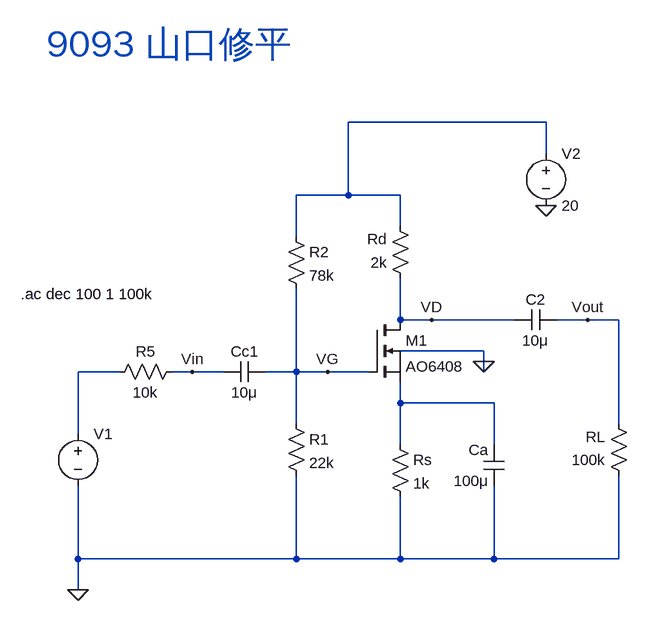
[diagram p0: schematic Draft6.asc]
Draft6.asc, the LTspice schematic file:
Version 4
SHEET 1 948 680
WIRE 816 -144 512 -144
WIRE 816 -96 816 -144
WIRE 512 -32 512 -144
WIRE 512 -32 432 -32
WIRE 592 -32 512 -32
WIRE 592 16 592 -32
WIRE 432 32 432 -32
WIRE 592 160 592 96
WIRE 640 160 592 160
WIRE 768 160 640 160
WIRE 880 160 832 160
WIRE 928 160 880 160
WIRE 720 208 592 208
WIRE 720 224 720 208
WIRE 160 240 96 240
WIRE 272 240 240 240
WIRE 320 240 272 240
WIRE 432 240 432 112
WIRE 432 240 384 240
WIRE 480 240 432 240
WIRE 544 240 480 240
WIRE 720 240 720 224
WIRE 592 288 592 256
WIRE 736 288 592 288
WIRE 432 320 432 240
WIRE 928 320 928 160
WIRE 96 336 96 240
WIRE 592 352 592 288
WIRE 736 352 736 288
WIRE 96 528 96 416
WIRE 432 528 432 400
WIRE 432 528 96 528
WIRE 592 528 592 432
WIRE 592 528 432 528
WIRE 736 528 736 416
WIRE 736 528 592 528
WIRE 928 528 928 400
WIRE 928 528 736 528
WIRE 96 576 96 528
FLAG 96 576 0
FLAG 720 224 0
FLAG 272 240 Vin
FLAG 880 160 Vout
FLAG 816 -16 0
FLAG 640 160 VD
FLAG 480 240 VG
SYMBOL nmos 544 160 R0
SYMATTR InstName M1
SYMATTR Value AO6408
SYMBOL voltage 96 320 R0
SYMATTR InstName V1
SYMATTR Value ""
SYMATTR Value2 AC 10m
SYMBOL voltage 816 -112 R0
SYMATTR InstName V2
SYMATTR Value 20
SYMBOL res 416 304 R0
SYMATTR InstName R1
SYMATTR Value 22k
SYMBOL res 416 16 R0
SYMATTR InstName R2
SYMATTR Value 78k
SYMBOL res 576 336 R0
SYMATTR InstName Rs
SYMATTR Value 1k
SYMBOL res 256 224 R90
WINDOW 0 0 56 VBottom 2
WINDOW 3 32 56 VTop 2
SYMATTR InstName R5
SYMATTR Value 10k
SYMBOL res 944 416 R180
WINDOW 0 36 76 Left 2
WINDOW 3 36 40 Left 2
SYMATTR InstName RL
SYMATTR Value 100k
SYMBOL res 608 112 R180
WINDOW 0 36 76 Left 2
WINDOW 3 36 40 Left 2
SYMATTR InstName Rd
SYMATTR Value 2k
SYMBOL cap 384 224 R90
WINDOW 0 0 32 VBottom 2
WINDOW 3 32 32 VTop 2
SYMATTR InstName Cc1
SYMATTR Value 10μ
SYMBOL cap 832 144 R90
WINDOW 0 0 32 VBottom 2
WINDOW 3 32 32 VTop 2
SYMATTR InstName C2
SYMATTR Value 10μ
SYMBOL cap 752 352 M0
SYMATTR InstName Ca
SYMATTR Value 100μ
TEXT 8 120 Left 2 !.ac dec 100 1 100k
TEXT 48 -264 Left 5 ;9093 山口修平

The netlist it stands for:
* Draft6.asc
M1 VD VG N003 N003 AO6408
V1 N002 0 AC 10m
V2 N001 0 20
R1 VG 0 22k
R2 N001 VG 78k
Rs N003 0 1k
R5 Vin N002 10k
RL 0 Vout 100k
Rd VD N001 2k
Cc1 VG Vin 10μ
C2 Vout VD 10μ
Ca N003 0 100μ
.model NMOS NMOS
.model PMOS PMOS
.lib standard.mos
.ac dec 100 1 100k
* 9093 山口修平
.backanno
.end